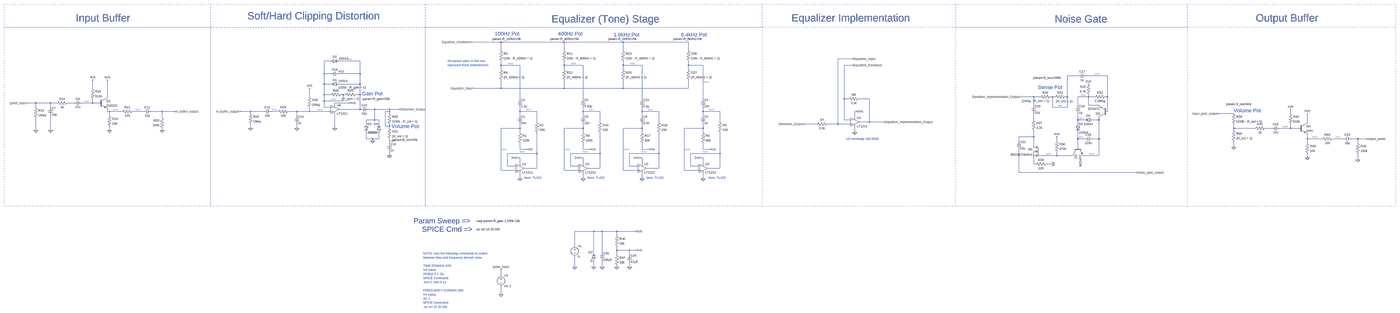
[diagram p0: schematic guitarmageddon.asc, whole sheet]
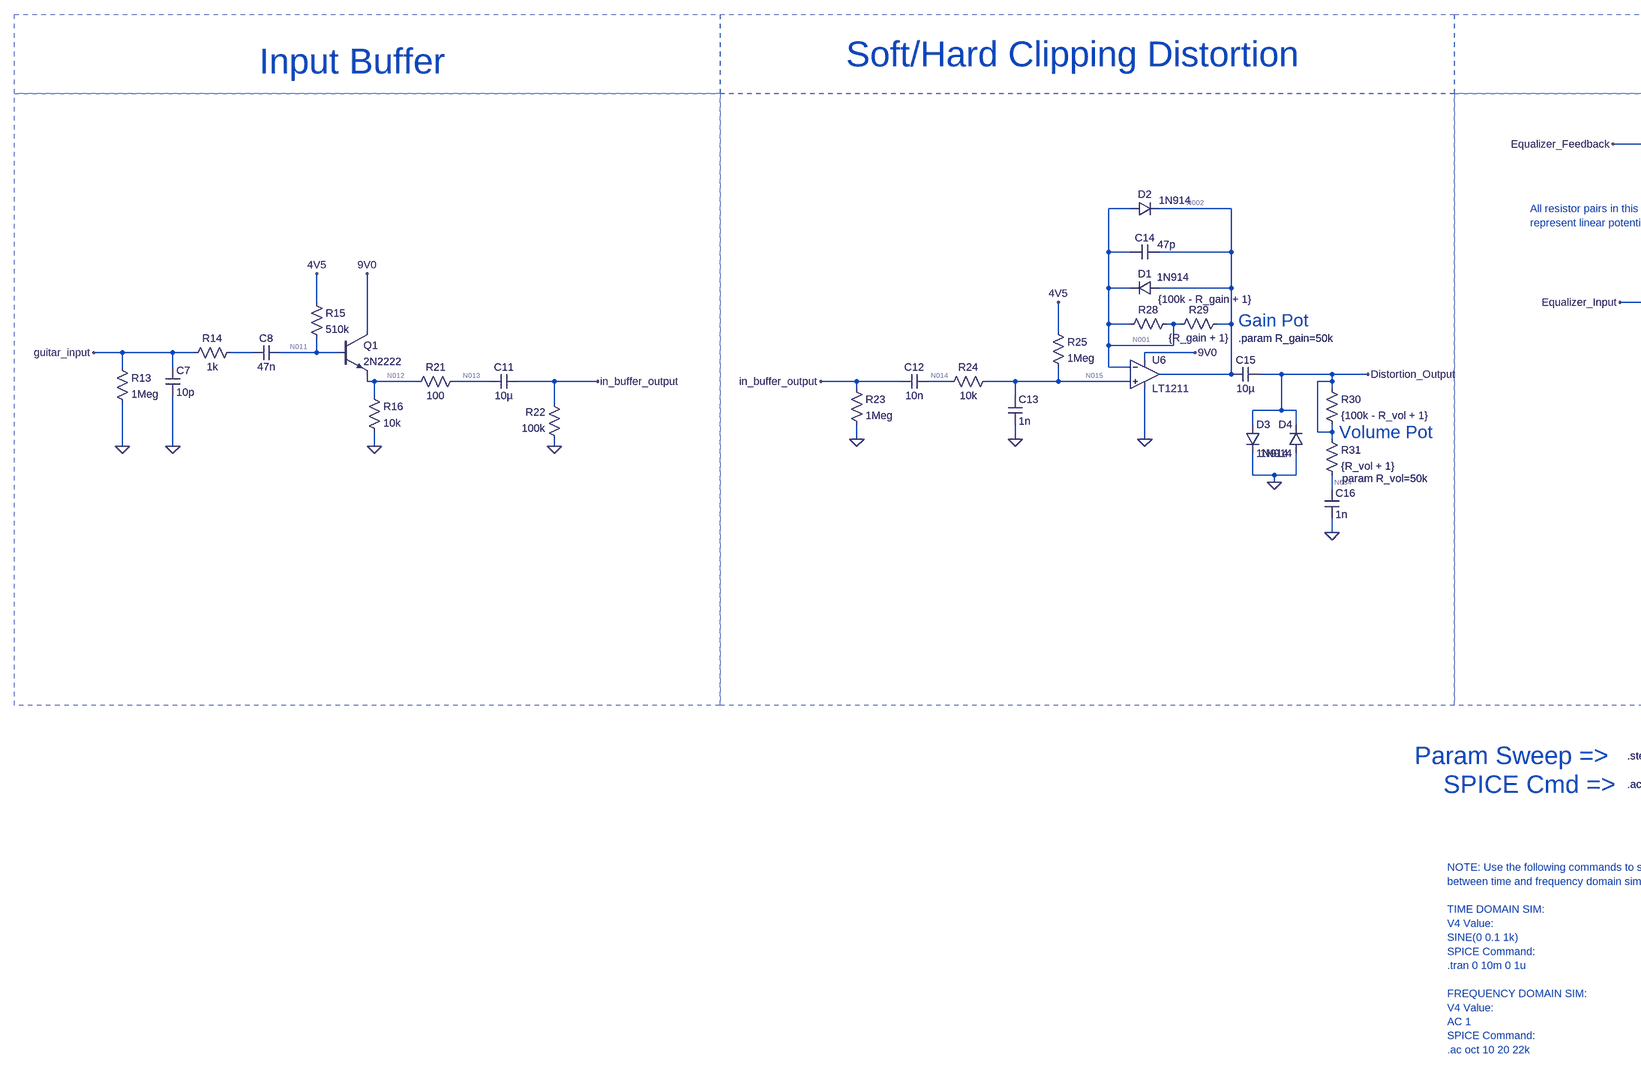
[diagram p1: schematic guitarmageddon.asc, part, row 1 of 1, column 1 of 3]
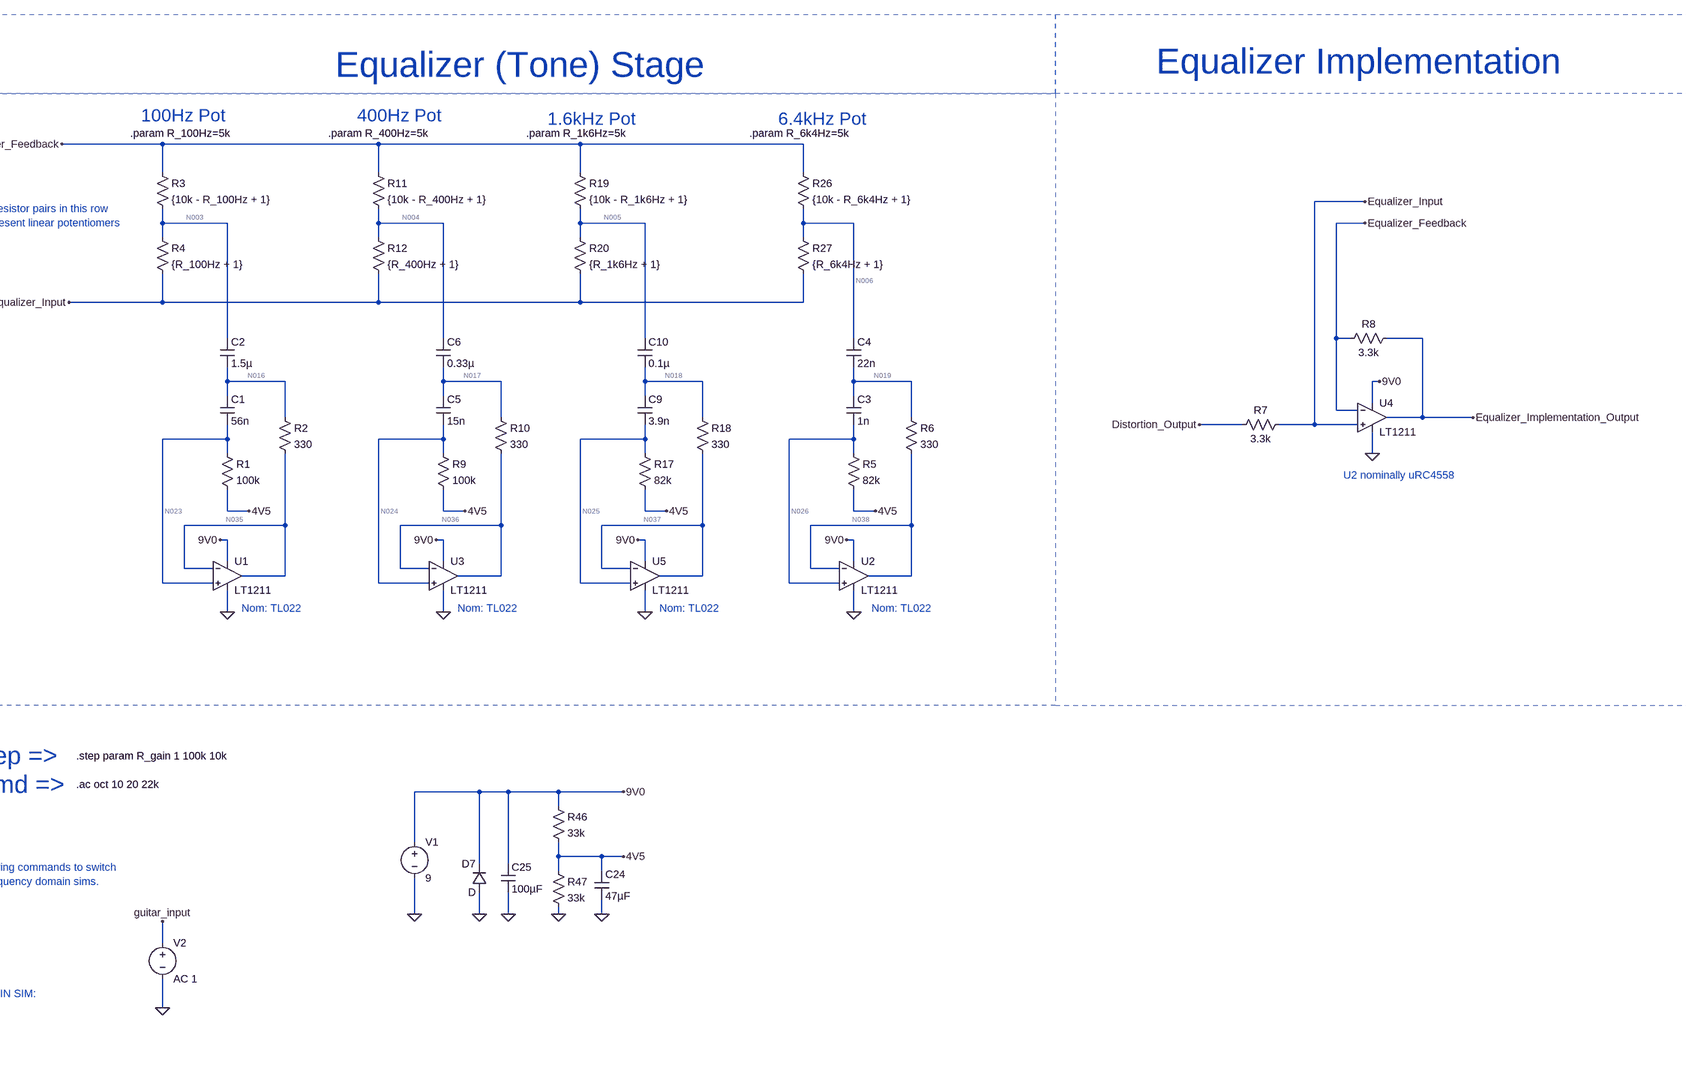
[diagram p2: schematic guitarmageddon.asc, part, row 1 of 1, column 2 of 3]
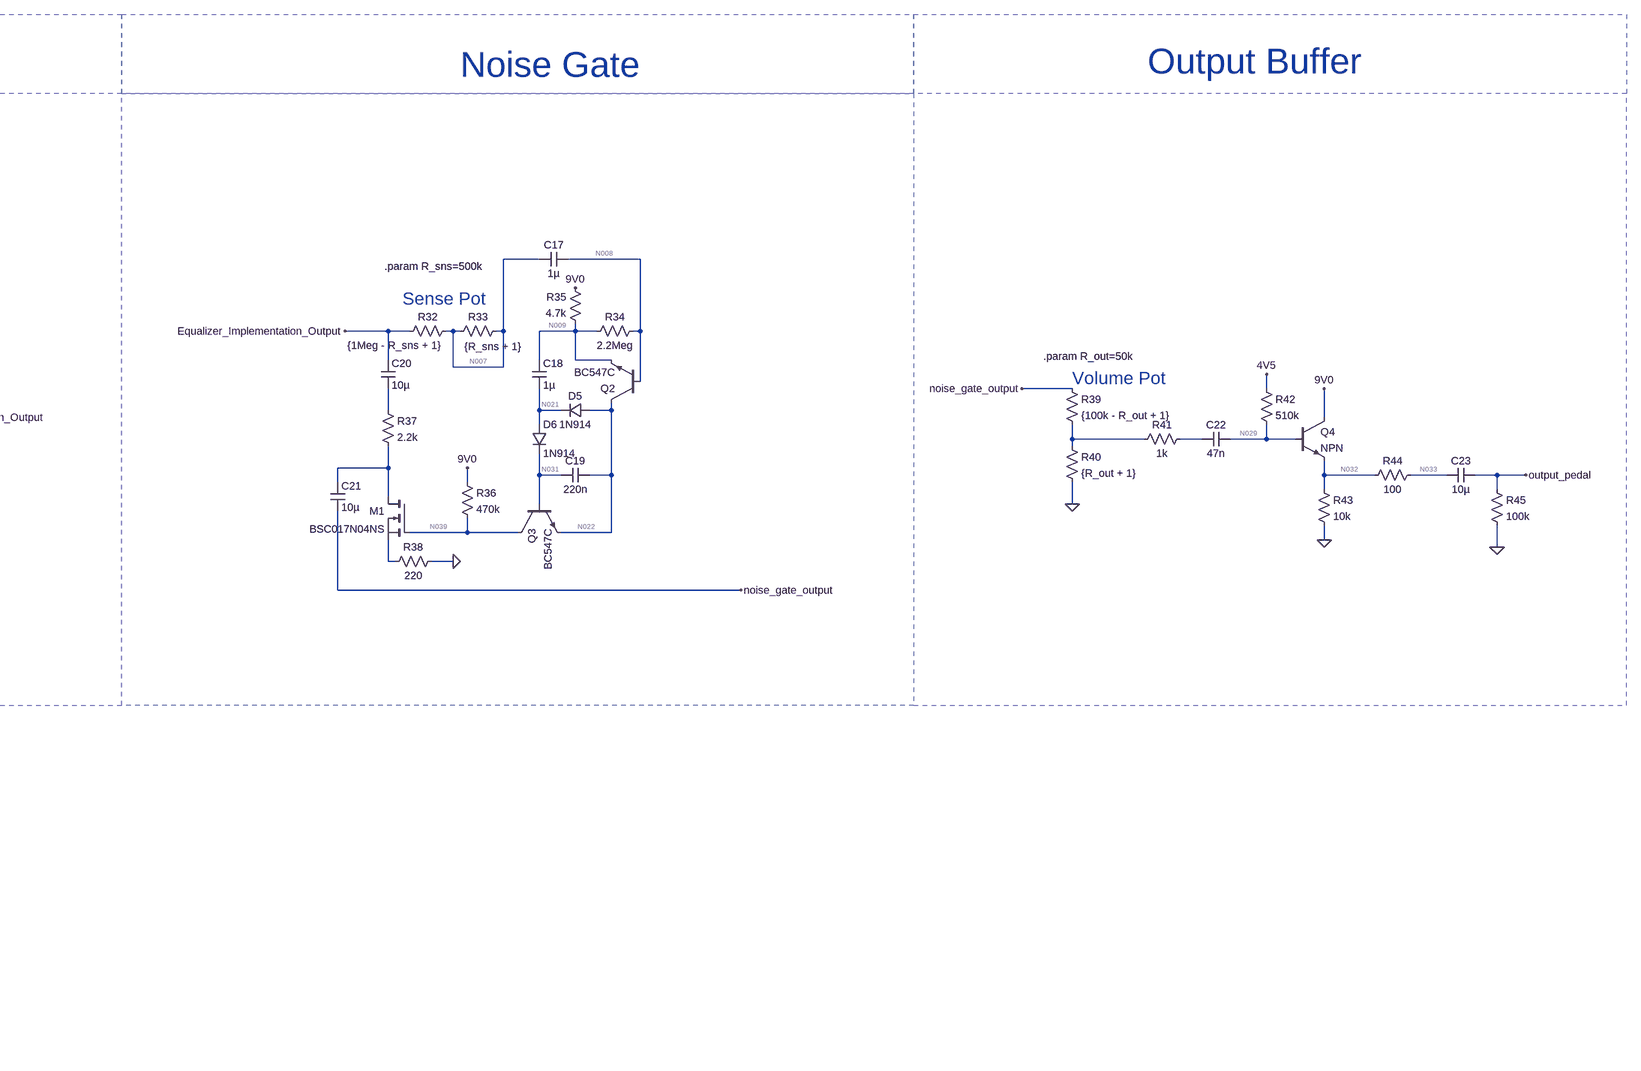
[diagram p3: schematic guitarmageddon.asc, part, row 1 of 1, column 3 of 3]
guitarmageddon.asc, the LTspice schematic file:
Version 4
SHEET 1 5732 1664
WIRE -1072 -512 -1296 -512
WIRE -592 -512 -1072 -512
WIRE -144 -512 -592 -512
WIRE 352 -512 -144 -512
WIRE -1072 -448 -1072 -512
WIRE -592 -448 -592 -512
WIRE -144 -448 -144 -512
WIRE 352 -448 352 -512
WIRE 1600 -384 1488 -384
WIRE -2368 -368 -2416 -368
WIRE -2144 -368 -2304 -368
WIRE -1072 -336 -1072 -368
WIRE -928 -336 -1072 -336
WIRE -592 -336 -592 -368
WIRE -448 -336 -592 -336
WIRE -144 -336 -144 -368
WIRE 0 -336 -144 -336
WIRE 352 -336 352 -368
WIRE 464 -336 352 -336
WIRE 1600 -336 1536 -336
WIRE -1072 -304 -1072 -336
WIRE -592 -304 -592 -336
WIRE -144 -304 -144 -336
WIRE 352 -304 352 -336
WIRE -2416 -272 -2416 -368
WIRE -2368 -272 -2416 -272
WIRE -2144 -272 -2144 -368
WIRE -2144 -272 -2304 -272
WIRE 3312 -256 3232 -256
WIRE 3536 -256 3376 -256
WIRE -2416 -192 -2416 -272
WIRE -2368 -192 -2416 -192
WIRE -2144 -192 -2144 -272
WIRE -2144 -192 -2304 -192
WIRE -4176 -160 -4176 -224
WIRE -1072 -160 -1072 -224
WIRE -1072 -160 -1280 -160
WIRE -592 -160 -592 -224
WIRE -592 -160 -1072 -160
WIRE -144 -160 -144 -224
WIRE -144 -160 -592 -160
WIRE 352 -160 352 -224
WIRE 352 -160 -144 -160
WIRE -2416 -112 -2416 -192
WIRE -2368 -112 -2416 -112
WIRE -2272 -112 -2288 -112
WIRE -2256 -112 -2272 -112
WIRE -2144 -112 -2144 -192
WIRE -2144 -112 -2176 -112
WIRE -4064 -96 -4064 -224
WIRE -2528 -96 -2528 -160
WIRE 2976 -96 2880 -96
WIRE 3024 -96 2976 -96
WIRE 3120 -96 3104 -96
WIRE 3136 -96 3120 -96
WIRE 3232 -96 3232 -256
WIRE 3232 -96 3216 -96
WIRE 3392 -96 3392 -112
WIRE 3392 -96 3312 -96
WIRE 3440 -96 3392 -96
WIRE 3536 -96 3536 -256
WIRE 3536 -96 3520 -96
WIRE -928 -80 -928 -336
WIRE -448 -80 -448 -336
WIRE 0 -80 0 -336
WIRE 464 -80 464 -336
WIRE 1536 -80 1536 -336
WIRE 1568 -80 1536 -80
WIRE 1728 -80 1648 -80
WIRE -2416 -64 -2416 -112
WIRE -2272 -64 -2272 -112
WIRE -2272 -64 -2416 -64
WIRE -4608 -48 -4672 -48
WIRE -4496 -48 -4608 -48
WIRE -4448 -48 -4496 -48
WIRE -4320 -48 -4368 -48
WIRE -4176 -48 -4176 -80
WIRE -4176 -48 -4256 -48
WIRE -4128 -48 -4176 -48
WIRE -2224 -48 -2336 -48
WIRE -2336 -32 -2336 -48
WIRE 2976 -32 2976 -96
WIRE 3312 -32 3312 -96
WIRE 3392 -32 3392 -96
WIRE 3472 -32 3392 -32
WIRE -4608 -16 -4608 -48
WIRE -4496 -16 -4496 -48
WIRE -2416 -16 -2416 -64
WIRE -2368 -16 -2416 -16
WIRE 3120 -16 3120 -96
WIRE 3232 -16 3232 -96
WIRE 3232 -16 3120 -16
WIRE -2144 0 -2144 -112
WIRE -2144 0 -2304 0
WIRE -2032 0 -2080 0
WIRE -1920 0 -2032 0
WIRE -1840 0 -1920 0
WIRE -4064 16 -4064 0
WIRE -4048 16 -4064 16
WIRE -3952 16 -4048 16
WIRE -3792 16 -3872 16
WIRE -3648 16 -3728 16
WIRE -3552 16 -3648 16
WIRE -2976 16 -3056 16
WIRE -2880 16 -2976 16
WIRE -2768 16 -2816 16
WIRE -2624 16 -2688 16
WIRE -2528 16 -2528 -16
WIRE -2528 16 -2624 16
WIRE -2368 16 -2528 16
WIRE -1920 16 -1920 0
WIRE -1920 16 -1952 16
WIRE -928 16 -928 -16
WIRE -800 16 -928 16
WIRE -448 16 -448 -16
WIRE -320 16 -448 16
WIRE 0 16 0 -16
WIRE 128 16 0 16
WIRE 464 16 464 -16
WIRE 592 16 464 16
WIRE 1632 16 1616 16
WIRE 3536 16 3536 -96
WIRE -2976 32 -2976 16
WIRE -1920 32 -1920 16
WIRE 4496 32 4384 32
WIRE 4928 32 4928 0
WIRE -4048 48 -4048 16
WIRE -2624 48 -2624 16
WIRE -928 48 -928 16
WIRE -448 48 -448 16
WIRE 0 48 0 16
WIRE 464 48 464 16
WIRE -3648 64 -3648 16
WIRE 1616 64 1616 16
WIRE -2032 80 -2032 0
WIRE -2032 80 -2096 80
WIRE -2000 80 -2032 80
WIRE 1536 80 1536 -80
WIRE 1584 80 1536 80
WIRE 2976 80 2976 32
WIRE 3312 80 3312 32
WIRE 3360 80 3312 80
WIRE 3472 80 3472 64
WIRE 3472 80 3424 80
WIRE -800 96 -800 16
WIRE -320 96 -320 16
WIRE 128 96 128 16
WIRE 592 96 592 16
WIRE 1728 96 1728 -80
WIRE 1728 96 1648 96
WIRE 1840 96 1728 96
WIRE 5056 96 5056 32
WIRE -2096 112 -2096 80
WIRE -2000 112 -2000 80
WIRE 1328 112 1232 112
WIRE 1488 112 1488 -384
WIRE 1488 112 1408 112
WIRE 1584 112 1488 112
WIRE 3312 112 3312 80
WIRE -1952 128 -1952 16
WIRE -1920 128 -1920 112
WIRE -1920 128 -1952 128
WIRE -2976 144 -2976 112
WIRE -2624 144 -2624 112
WIRE -2336 144 -2336 32
WIRE -1920 144 -1920 128
WIRE -928 144 -928 112
WIRE -928 144 -1072 144
WIRE -448 144 -448 112
WIRE -448 144 -592 144
WIRE 0 144 0 112
WIRE 0 144 -144 144
WIRE 464 144 464 112
WIRE 464 144 320 144
WIRE 4496 144 4496 112
WIRE 4656 144 4496 144
WIRE 4784 144 4736 144
WIRE 4928 144 4928 112
WIRE 4928 144 4848 144
WIRE 4992 144 4928 144
WIRE -4608 160 -4608 64
WIRE -4496 160 -4496 48
WIRE -4048 160 -4048 128
WIRE -3648 160 -3648 144
WIRE 4496 160 4496 144
WIRE -928 176 -928 144
WIRE -448 176 -448 144
WIRE 0 176 0 144
WIRE 464 176 464 144
WIRE 1616 176 1616 128
WIRE 2976 208 2976 160
WIRE 2976 208 2864 208
WIRE -2096 224 -2096 176
WIRE -2048 224 -2096 224
WIRE -2000 224 -2000 176
WIRE -2000 224 -2048 224
WIRE 3312 224 3312 176
WIRE 3360 224 3312 224
WIRE 3472 224 3472 80
WIRE 3472 224 3424 224
WIRE 5056 224 5056 192
WIRE 5168 224 5056 224
WIRE 5328 224 5248 224
WIRE 5440 224 5392 224
WIRE 5504 224 5440 224
WIRE -2048 240 -2048 224
WIRE 2864 240 2864 208
WIRE 3152 240 3152 208
WIRE -1920 256 -1920 224
WIRE 5056 256 5056 224
WIRE 5440 256 5440 224
WIRE 2976 272 2976 208
WIRE 3312 288 3312 224
WIRE 4496 288 4496 240
WIRE -928 304 -928 256
WIRE -880 304 -928 304
WIRE -448 304 -448 256
WIRE -400 304 -448 304
WIRE 0 304 0 256
WIRE 48 304 0 304
WIRE 464 304 464 256
WIRE 512 304 464 304
WIRE -800 336 -800 176
WIRE -800 336 -1024 336
WIRE -320 336 -320 176
WIRE -320 336 -544 336
WIRE 128 336 128 176
WIRE 128 336 -96 336
WIRE 592 336 592 176
WIRE 592 336 368 336
WIRE -1920 352 -1920 320
WIRE 3152 352 3152 320
WIRE 3152 352 3024 352
WIRE 3264 352 3152 352
WIRE 3472 352 3472 224
WIRE 3472 352 3360 352
WIRE -928 368 -944 368
WIRE -448 368 -464 368
WIRE 0 368 -16 368
WIRE 464 368 448 368
WIRE 5056 368 5056 336
WIRE 5440 384 5440 336
WIRE -928 416 -928 368
WIRE -448 416 -448 368
WIRE 0 416 0 368
WIRE 464 416 464 368
WIRE 2976 416 2976 368
WIRE 2992 416 2976 416
WIRE 3120 416 3072 416
WIRE -1024 432 -1024 336
WIRE -960 432 -1024 432
WIRE -544 432 -544 336
WIRE -480 432 -544 432
WIRE -96 432 -96 336
WIRE -32 432 -96 432
WIRE 368 432 368 336
WIRE 432 432 368 432
WIRE -800 448 -800 336
WIRE -800 448 -896 448
WIRE -320 448 -320 336
WIRE -320 448 -416 448
WIRE 128 448 128 336
WIRE 128 448 32 448
WIRE 592 448 592 336
WIRE 592 448 496 448
WIRE -1072 464 -1072 144
WIRE -960 464 -1072 464
WIRE -592 464 -592 144
WIRE -480 464 -592 464
WIRE -144 464 -144 144
WIRE -32 464 -144 464
WIRE 320 464 320 144
WIRE 432 464 320 464
WIRE 2864 480 2864 304
WIRE 3760 480 2864 480
WIRE -928 528 -928 480
WIRE -448 528 -448 480
WIRE 0 528 0 480
WIRE 464 528 464 480
WIRE -368 928 -512 928
WIRE -304 928 -368 928
WIRE -192 928 -304 928
WIRE -48 928 -192 928
WIRE -192 960 -192 928
WIRE -512 1040 -512 928
WIRE -192 1072 -192 1040
WIRE -96 1072 -192 1072
WIRE -48 1072 -96 1072
WIRE -368 1088 -368 928
WIRE -304 1088 -304 928
WIRE -192 1104 -192 1072
WIRE -96 1104 -96 1072
WIRE -512 1200 -512 1120
WIRE -368 1200 -368 1152
WIRE -304 1200 -304 1152
WIRE -192 1200 -192 1184
WIRE -96 1200 -96 1168
WIRE -1072 1264 -1072 1216
WIRE -1072 1408 -1072 1344
FLAG -928 528 0
FLAG -448 528 0
FLAG 0 528 0
FLAG -1280 -160 Equalizer_Input
FLAG -1296 -512 Equalizer_Feedback
FLAG -880 304 4V5
FLAG -400 304 4V5
FLAG 48 304 4V5
FLAG -944 368 9V0
FLAG -464 368 9V0
FLAG -16 368 9V0
FLAG 464 528 0
FLAG 512 304 4V5
FLAG 448 368 9V0
FLAG 1616 176 0
FLAG 1632 16 9V0
FLAG 1600 -384 Equalizer_Input
FLAG 1600 -336 Equalizer_Feedback
FLAG 1840 96 Equalizer_Implementation_Output
FLAG 1232 112 Distortion_Output
FLAG -4672 -48 guitar_input
FLAG -3552 16 in_buffer_output
FLAG -4608 160 0
FLAG -4496 160 0
FLAG -4048 160 0
FLAG -3648 160 0
FLAG -4064 -224 9V0
FLAG -4176 -224 4V5
FLAG -3056 16 in_buffer_output
FLAG -2976 144 0
FLAG -2624 144 0
FLAG -2528 -160 4V5
FLAG -2336 144 0
FLAG -2224 -48 9V0
FLAG -2048 240 0
FLAG -1920 352 0
FLAG -1840 0 Distortion_Output
FLAG 2880 -96 Equalizer_Implementation_Output
FLAG 3152 208 9V0
FLAG 3392 -192 9V0
FLAG 3760 480 noise_gate_output
FLAG 3120 416 0
FLAG 4384 32 noise_gate_output
FLAG 4496 288 0
FLAG 5056 368 0
FLAG 4928 0 4V5
FLAG 5056 32 9V0
FLAG 5440 384 0
FLAG 5504 224 output_pedal
FLAG -192 1200 0
FLAG -96 1200 0
FLAG -48 928 9V0
FLAG -512 1200 0
FLAG -48 1072 4V5
FLAG -368 1200 0
FLAG -304 1200 0
FLAG -1072 1408 0
FLAG -1072 1216 guitar_input
SYMBOL Opamps\\LT1211 -928 384 R0
SYMATTR InstName U1
SYMBOL res -944 160 R0
SYMATTR InstName R1
SYMATTR Value 100k
SYMBOL res -816 80 R0
SYMATTR InstName R2
SYMATTR Value 330
SYMBOL cap -944 48 R0
SYMATTR InstName C1
SYMATTR Value 56n
SYMBOL cap -944 -80 R0
SYMATTR InstName C2
SYMATTR Value 1.5µ
SYMBOL res -1088 -464 R0
SYMATTR InstName R3
SYMATTR Value {10k - R_100Hz + 1}
SYMBOL res -1088 -320 R0
SYMATTR InstName R4
SYMATTR Value {R_100Hz + 1}
SYMBOL Opamps\\LT1211 -448 384 R0
SYMATTR InstName U3
SYMBOL res -464 160 R0
SYMATTR InstName R9
SYMATTR Value 100k
SYMBOL res -336 80 R0
SYMATTR InstName R10
SYMATTR Value 330
SYMBOL cap -464 48 R0
SYMATTR InstName C5
SYMATTR Value 15n
SYMBOL cap -464 -80 R0
SYMATTR InstName C6
SYMATTR Value 0.33µ
SYMBOL res -608 -464 R0
SYMATTR InstName R11
SYMATTR Value {10k - R_400Hz + 1}
SYMBOL res -608 -320 R0
SYMATTR InstName R12
SYMATTR Value {R_400Hz + 1}
SYMBOL Opamps\\LT1211 0 384 R0
SYMATTR InstName U5
SYMBOL res -16 160 R0
SYMATTR InstName R17
SYMATTR Value 82k
SYMBOL res 112 80 R0
SYMATTR InstName R18
SYMATTR Value 330
SYMBOL cap -16 48 R0
SYMATTR InstName C9
SYMATTR Value 3.9n
SYMBOL cap -16 -80 R0
SYMATTR InstName C10
SYMATTR Value 0.1µ
SYMBOL res -160 -464 R0
SYMATTR InstName R19
SYMATTR Value {10k - R_1k6Hz + 1}
SYMBOL res -160 -320 R0
SYMATTR InstName R20
SYMATTR Value {R_1k6Hz + 1}
SYMBOL res 336 -464 R0
SYMATTR InstName R26
SYMATTR Value {10k - R_6k4Hz + 1}
SYMBOL res 336 -320 R0
SYMATTR InstName R27
SYMATTR Value {R_6k4Hz + 1}
SYMBOL Opamps\\LT1211 464 384 R0
SYMATTR InstName U2
SYMBOL res 448 160 R0
SYMATTR InstName R5
SYMATTR Value 82k
SYMBOL res 576 80 R0
SYMATTR InstName R6
SYMATTR Value 330
SYMBOL cap 448 48 R0
SYMATTR InstName C3
SYMATTR Value 1n
SYMBOL cap 448 -80 R0
SYMATTR InstName C4
SYMATTR Value 22n
SYMBOL res 1424 96 R90
WINDOW 0 0 56 VBottom 2
WINDOW 3 32 56 VTop 2
SYMATTR InstName R7
SYMATTR Value 3.3k
SYMBOL Opamps\\LT1211 1616 32 R0
SYMATTR InstName U4
SYMBOL res 1664 -96 R90
WINDOW 0 0 56 VBottom 2
WINDOW 3 32 56 VTop 2
SYMATTR InstName R8
SYMATTR Value 3.3k
SYMBOL res -4352 -64 R90
WINDOW 0 0 56 VBottom 2
WINDOW 3 32 56 VTop 2
SYMATTR InstName R14
SYMATTR Value 1k
SYMBOL cap -4256 -64 R90
WINDOW 0 0 32 VBottom 2
WINDOW 3 32 32 VTop 2
SYMATTR InstName C8
SYMATTR Value 47n
SYMBOL res -4192 -176 R0
SYMATTR InstName R15
SYMATTR Value 510k
SYMBOL res -4064 32 R0
SYMATTR InstName R16
SYMATTR Value 10k
SYMBOL res -3856 0 R90
WINDOW 0 0 56 VBottom 2
WINDOW 3 32 56 VTop 2
SYMATTR InstName R21
SYMATTR Value 100
SYMBOL res -3632 160 R180
WINDOW 0 36 76 Left 2
WINDOW 3 36 40 Left 2
SYMATTR InstName R22
SYMATTR Value 100k
SYMBOL cap -3728 0 R90
WINDOW 0 0 32 VBottom 2
WINDOW 3 32 32 VTop 2
SYMATTR InstName C11
SYMATTR Value 10µ
SYMBOL res -4624 -32 R0
SYMATTR InstName R13
SYMATTR Value 1Meg
SYMBOL cap -4512 -16 R0
SYMATTR InstName C7
SYMATTR Value 10p
SYMBOL npn -4128 -96 R0
SYMATTR InstName Q1
SYMATTR Value 2N2222
SYMBOL res -2992 16 R0
SYMATTR InstName R23
SYMATTR Value 1Meg
SYMBOL cap -2816 0 R90
WINDOW 0 0 32 VBottom 2
WINDOW 3 32 32 VTop 2
SYMATTR InstName C12
SYMATTR Value 10n
SYMBOL res -2672 0 R90
WINDOW 0 0 56 VBottom 2
WINDOW 3 32 56 VTop 2
SYMATTR InstName R24
SYMATTR Value 10k
SYMBOL cap -2640 48 R0
SYMATTR InstName C13
SYMATTR Value 1n
SYMBOL res -2544 -112 R0
SYMATTR InstName R25
SYMATTR Value 1Meg
SYMBOL Opamps\\LT1211 -2336 -64 R0
SYMATTR InstName U6
SYMBOL cap -2304 -288 R90
WINDOW 0 0 32 VBottom 2
WINDOW 3 -16 -16 VTop 2
SYMATTR InstName C14
SYMATTR Value 47p
SYMBOL res -2272 -128 R90
WINDOW 0 0 56 VBottom 2
WINDOW 3 -39 34 VLeft 2
SYMATTR InstName R28
SYMATTR Value {100k - R_gain + 1}
SYMBOL res -2160 -128 R90
WINDOW 0 0 56 VBottom 2
WINDOW 3 32 56 VTop 2
SYMATTR InstName R29
SYMATTR Value {R_gain + 1}
SYMBOL diode -2304 -208 R90
WINDOW 0 0 32 VBottom 2
WINDOW 3 -23 -31 VTop 2
SYMATTR InstName D1
SYMATTR Value 1N914
SYMBOL diode -2368 -352 R270
WINDOW 0 32 32 VTop 2
WINDOW 3 50 99 VBottom 2
SYMATTR InstName D2
SYMATTR Value 1N914
SYMBOL cap -2080 -16 R90
WINDOW 0 0 32 VBottom 2
WINDOW 3 32 32 VTop 2
SYMATTR InstName C15
SYMATTR Value 10µ
SYMBOL res -1936 16 R0
SYMATTR InstName R30
SYMATTR Value {100k - R_vol + 1}
SYMBOL diode -2112 112 R0
SYMATTR InstName D3
SYMATTR Value 1N914
SYMBOL diode -1984 176 R180
WINDOW 0 24 64 Left 2
WINDOW 3 24 0 Left 2
SYMATTR InstName D4
SYMATTR Value 1N914
SYMBOL res -1936 128 R0
SYMATTR InstName R31
SYMATTR Value {R_vol + 1}
SYMBOL cap -1936 256 R0
SYMATTR InstName C16
SYMATTR Value 1n
SYMBOL res 3120 -112 R90
WINDOW 0 0 56 VBottom 2
WINDOW 3 32 130 VTop 2
SYMATTR InstName R32
SYMATTR Value {1Meg - R_sns + 1}
SYMBOL res 3232 -112 R90
WINDOW 0 0 56 VBottom 2
WINDOW 3 35 24 VTop 2
SYMATTR InstName R33
SYMATTR Value {R_sns + 1}
SYMBOL cap 3376 -272 R90
WINDOW 0 0 32 VBottom 2
WINDOW 3 32 32 VTop 2
SYMATTR InstName C17
SYMATTR Value 1µ
SYMBOL res 3536 -112 R90
WINDOW 0 0 56 VBottom 2
WINDOW 3 32 56 VTop 2
SYMATTR InstName R34
SYMATTR Value 2.2Meg
SYMBOL res 3408 -96 R180
WINDOW 0 36 76 Left 2
WINDOW 3 36 40 Left 2
SYMATTR InstName R35
SYMATTR Value 4.7k
SYMBOL cap 3296 -32 R0
SYMATTR InstName C18
SYMATTR Value 1µ
SYMBOL diode 3424 64 R90
WINDOW 0 0 32 VBottom 2
WINDOW 3 32 32 VTop 2
SYMATTR InstName D5
SYMATTR Value 1N914
SYMBOL diode 3296 112 R0
SYMATTR InstName D6
SYMATTR Value 1N914
SYMBOL cap 3424 208 R90
WINDOW 0 0 32 VBottom 2
WINDOW 3 32 32 VTop 2
SYMATTR InstName C19
SYMATTR Value 220n
SYMBOL npn 3536 64 R180
SYMATTR InstName Q2
SYMATTR Value BC547C
SYMBOL npn 3264 288 M90
SYMATTR InstName Q3
SYMATTR Value BC547C
SYMBOL res 3136 224 R0
SYMATTR InstName R36
SYMATTR Value 470k
SYMBOL cap 2960 -32 R0
SYMATTR InstName C20
SYMATTR Value 10µ
SYMBOL res 2960 64 R0
SYMATTR InstName R37
SYMATTR Value 2.2k
SYMBOL nmos 3024 272 M0
SYMATTR InstName M1
SYMATTR Value BSC017N04NS
SYMBOL cap 2848 240 R0
SYMATTR InstName C21
SYMATTR Value 10µ
SYMBOL res 3088 400 R90
WINDOW 0 0 56 VBottom 2
WINDOW 3 32 56 VTop 2
SYMATTR InstName R38
SYMATTR Value 220
SYMBOL res 4480 16 R0
SYMATTR InstName R39
SYMATTR Value {100k - R_out + 1}
SYMBOL res 4480 144 R0
SYMATTR InstName R40
SYMATTR Value {R_out + 1}
SYMBOL res 4752 128 R90
WINDOW 0 0 56 VBottom 2
WINDOW 3 32 56 VTop 2
SYMATTR InstName R41
SYMATTR Value 1k
SYMBOL cap 4848 128 R90
WINDOW 0 0 32 VBottom 2
WINDOW 3 32 32 VTop 2
SYMATTR InstName C22
SYMATTR Value 47n
SYMBOL res 4912 16 R0
SYMATTR InstName R42
SYMATTR Value 510k
SYMBOL npn 4992 96 R0
SYMATTR InstName Q4
SYMBOL res 5040 240 R0
SYMATTR InstName R43
SYMATTR Value 10k
SYMBOL res 5264 208 R90
WINDOW 0 0 56 VBottom 2
WINDOW 3 32 56 VTop 2
SYMATTR InstName R44
SYMATTR Value 100
SYMBOL cap 5392 208 R90
WINDOW 0 0 32 VBottom 2
WINDOW 3 32 32 VTop 2
SYMATTR InstName C23
SYMATTR Value 10µ
SYMBOL res 5424 240 R0
SYMATTR InstName R45
SYMATTR Value 100k
SYMBOL res -208 944 R0
SYMATTR InstName R46
SYMATTR Value 33k
SYMBOL res -208 1088 R0
SYMATTR InstName R47
SYMATTR Value 33k
SYMBOL cap -112 1104 R0
SYMATTR InstName C24
SYMATTR Value 47µF
SYMBOL voltage -512 1024 R0
SYMATTR InstName V1
SYMATTR Value 9
SYMATTR SpiceLine Rser=0
SYMBOL cap -320 1088 R0
SYMATTR InstName C25
SYMATTR Value 100µF
SYMBOL diode -352 1152 R180
WINDOW 0 24 64 Left 2
WINDOW 3 24 0 Left 2
SYMATTR InstName D7
SYMBOL voltage -1072 1248 R0
SYMATTR InstName V2
SYMATTR Value AC 1
SYMATTR SpiceLine Rser=0
TEXT -1120 -576 Left 4 ;100Hz Pot
TEXT -640 -576 Left 4 ;400Hz Pot
TEXT -216 -568 Left 4 ;1.6kHz Pot
TEXT 296 -568 Left 4 ;6.4kHz Pot
TEXT -688 -688 Left 6 ;Equalizer (Tone) Stage
TEXT -1144 -536 Left 2 !.param R_100Hz=5k
TEXT -704 -536 Left 2 !.param R_400Hz=5k
TEXT -264 -536 Left 2 !.param R_1k6Hz=5k
TEXT -896 520 Left 2 ;Nom: TL022
TEXT -416 520 Left 2 ;Nom: TL022
TEXT 32 520 Left 2 ;Nom: TL022
TEXT -1480 -368 Left 2 ;All resistor pairs in this row \nrepresent linear potentiomers
TEXT 504 520 Left 2 ;Nom: TL022
TEXT 232 -536 Left 2 !.param R_6k4Hz=5k
TEXT 1552 224 Left 2 ;U2 nominally uRC4558
TEXT 1136 -696 Left 6 ;Equalizer Implementation
TEXT -3000 -712 Left 6 ;Soft/Hard Clipping Distortion
TEXT -4304 -696 Left 6 ;Input Buffer
TEXT 3136 -688 Left 6 ;Noise Gate
TEXT 4664 -696 Left 6 ;Output Buffer
TEXT 3008 -168 Left 4 ;Sense Pot
TEXT -2128 -120 Left 4 ;Gain Pot
TEXT -1904 128 Left 4 ;Volume Pot
TEXT 4496 8 Left 4 ;Volume Pot
TEXT -1664 1096 Left 2 ;NOTE: Use the following commands to switch \nbetween time and frequency domain sims.\n \nTIME DOMAIN SIM:\nV4 Value: \nSINE(0 0.1 1k)\nSPICE Command: \n.tran 0 10m 0 1u\n \nFREQUENCY DOMAIN SIM:\nV4 Value: \nAC 1\nSPICE Command:\n.ac oct 10 20 22k
TEXT -1264 848 Left 2 !.step param R_gain 1 100k 10k
TEXT -1264 912 Left 2 !.ac oct 10 20 22k
TEXT -1672 912 Left 5 ;SPICE Cmd =>
TEXT -1736 848 Left 5 ;Param Sweep =>
TEXT -2128 -80 Left 2 !.param R_gain=50k
TEXT -1904 232 Left 2 !.param R_vol=50k
TEXT 2968 -240 Left 2 !.param R_sns=500k
TEXT 4432 -40 Left 2 !.param R_out=50k
RECTANGLE Normal 912 736 -1648 -624 2
RECTANGLE Normal 2384 -624 912 736 2
RECTANGLE Normal -1648 736 -3280 -624 2
RECTANGLE Normal -4848 -624 -3280 736 2
RECTANGLE Normal 4144 736 2384 -624 2
RECTANGLE Normal 5728 -624 4144 736 2
RECTANGLE Normal 4144 -800 5728 -624 2
RECTANGLE Normal 2384 -800 4144 -624 2
RECTANGLE Normal 912 -800 2384 -624 2
RECTANGLE Normal -1648 -800 912 -624 2
RECTANGLE Normal -3280 -800 -1648 -624 2
RECTANGLE Normal -4848 -800 -3280 -624 2

The netlist it stands for:
* guitarmageddon.asc
XU1 N023 N035 9V0 0 N035 LT1211  ; pins In+ In- V+ V- OUT
R1 N023 4V5 100k
R2 N016 N035 330
C1 N016 N023 56n
C2 N003 N016 1.5µ
R3 Equalizer_Feedback N003 {10k - R_100Hz + 1}
R4 N003 Equalizer_Input {R_100Hz + 1}
XU3 N024 N036 9V0 0 N036 LT1211  ; pins In+ In- V+ V- OUT
R9 N024 4V5 100k
R10 N017 N036 330
C5 N017 N024 15n
C6 N004 N017 0.33µ
R11 Equalizer_Feedback N004 {10k - R_400Hz + 1}
R12 N004 Equalizer_Input {R_400Hz + 1}
XU5 N025 N037 9V0 0 N037 LT1211  ; pins In+ In- V+ V- OUT
R17 N025 4V5 82k
R18 N018 N037 330
C9 N018 N025 3.9n
C10 N005 N018 0.1µ
R19 Equalizer_Feedback N005 {10k - R_1k6Hz + 1}
R20 N005 Equalizer_Input {R_1k6Hz + 1}
R26 Equalizer_Feedback N006 {10k - R_6k4Hz + 1}
R27 N006 Equalizer_Input {R_6k4Hz + 1}
XU2 N026 N038 9V0 0 N038 LT1211  ; pins In+ In- V+ V- OUT
R5 N026 4V5 82k
R6 N019 N038 330
C3 N019 N026 1n
C4 N006 N019 22n
R7 Equalizer_Input Distortion_Output 3.3k
XU4 Equalizer_Input Equalizer_Feedback 9V0 0 Equalizer_Implementation_Output LT1211  ; pins In+ In- V+ V- OUT
R8 Equalizer_Implementation_Output Equalizer_Feedback 3.3k
R14 N010 guitar_input 1k
C8 N011 N010 47n
R15 4V5 N011 510k
R16 N012 0 10k
R21 N013 N012 100
R22 0 in_buffer_output 100k
C11 in_buffer_output N013 10µ
R13 guitar_input 0 1Meg
C7 guitar_input 0 10p
Q1 9V0 N011 N012 0 2N2222
R23 in_buffer_output 0 1Meg
C12 N014 in_buffer_output 10n
R24 N015 N014 10k
C13 N015 0 1n
R25 4V5 N015 1Meg
XU6 N015 N001 9V0 0 N002 LT1211  ; pins In+ In- V+ V- OUT
C14 N002 N001 47p
R28 N001 N001 {100k - R_gain + 1}
R29 N002 N001 {R_gain + 1}
D1 N002 N001 1N914
D2 N001 N002 1N914
C15 Distortion_Output N002 10µ
R30 Distortion_Output Distortion_Output {100k - R_vol + 1}
D3 Distortion_Output 0 1N914
D4 0 Distortion_Output 1N914
R31 Distortion_Output N034 {R_vol + 1}
C16 N034 0 1n
R32 N007 Equalizer_Implementation_Output {1Meg - R_sns + 1}
R33 N007 N007 {R_sns + 1}
C17 N008 N007 1µ
R34 N008 N009 2.2Meg
R35 N009 9V0 4.7k
C18 N009 N021 1µ
D5 N022 N021 1N914
D6 N021 N031 1N914
C19 N022 N031 220n
Q2 N022 N008 N009 0 BC547C
Q3 N039 N031 N022 0 BC547C
R36 9V0 N039 470k
C20 Equalizer_Implementation_Output N020 10µ
R37 N020 N030 2.2k
M1 N030 N039 N040 N040 BSC017N04NS
C21 N030 noise_gate_output 10µ
R38 0 N040 220
R39 noise_gate_output N027 {100k - R_out + 1}
R40 N027 0 {R_out + 1}
R41 N028 N027 1k
C22 N029 N028 47n
R42 4V5 N029 510k
Q4 9V0 N029 N032 0 NPN
R43 N032 0 10k
R44 N033 N032 100
C23 output_pedal N033 10µ
R45 output_pedal 0 100k
R46 9V0 4V5 33k
R47 4V5 0 33k
C24 4V5 0 47µF
V1 9V0 0 9 Rser=0
C25 9V0 0 100µF
D7 0 9V0 D
V2 guitar_input 0 AC 1 Rser=0
.model D D
.lib standard.dio
.model NPN NPN
.model PNP PNP
.lib standard.bjt
.model NMOS NMOS
.model PMOS PMOS
.lib standard.mos
* 100Hz Pot
* 400Hz Pot
* 1.6kHz Pot
* 6.4kHz Pot
* Equalizer (Tone) Stage
.param R_100Hz=5k
.param R_400Hz=5k
.param R_1k6Hz=5k
* Nom: TL022
* Nom: TL022
* Nom: TL022
* All resistor pairs in this row
* represent linear potentiomers
* Nom: TL022
.param R_6k4Hz=5k
* U2 nominally uRC4558
* Equalizer Implementation
* Soft/Hard Clipping Distortion
* Input Buffer
* Noise Gate
* Output Buffer
* Sense Pot
* Gain Pot
* Volume Pot
* Volume Pot
* NOTE: Use the following commands to switch
* between time and frequency domain sims.
* TIME DOMAIN SIM:
* V4 Value:
* SINE(0 0.1 1k)
* SPICE Command:
* .tran 0 10m 0 1u
* FREQUENCY DOMAIN SIM:
* V4 Value:
* AC 1
* SPICE Command:
* .ac oct 10 20 22k
.step param R_gain 1 100k 10k
.ac oct 10 20 22k
* SPICE Cmd =>
* Param Sweep =>
.param R_gain=50k
.param R_vol=50k
.param R_sns=500k
.param R_out=50k
.lib LTC.lib
.backanno
.end

* Results of the author's LTspice run, read from the files saved beside the schematic
* Operating Point (first step), zero values left out:
*   r_gain = 1 
*   V(n035) = 4.445 V
*   V(n023) = 4.445 V
*   V(9v0) = 9 V
*   V(4v5) = 4.44 V
*   V(n016) = 4.445 V
*   V(n003) = 143.6 mV
*   V(equalizer_feedback) = 143.6 mV
*   V(equalizer_input) = 143.6 mV
*   V(n036) = 4.445 V
*   V(n024) = 4.445 V
*   V(n017) = 4.445 V
*   V(n004) = 143.6 mV
*   V(n037) = 4.444 V
*   V(n025) = 4.444 V
*   V(n018) = 4.444 V
*   V(n005) = 143.6 mV
*   V(n006) = 143.6 mV
*   V(n038) = 4.444 V
*   V(n026) = 4.444 V
*   V(n019) = 4.444 V
*   V(distortion_output) = 143.4 mV
*   V(equalizer_implementation_output) = 143.4 mV
*   V(n011) = 3.698 V
*   V(n012) = 3.075 V
*   V(n013) = 3.075 V
*   V(n014) = 4.49 V
*   V(n015) = 4.49 V
*   V(n001) = 4.49 V
*   V(n002) = 4.49 V
*   V(n034) = 143.4 mV
*   V(n007) = 143.4 mV
*   V(n008) = 9 V
*   V(n009) = 9 V
*   V(n021) = 8.999 V
*   V(n022) = 8.999 V
*   V(n031) = 8.999 V
*   V(n039) = 9 V
*   V(n029) = 3.198 V
*   V(n032) = 2.46 V
*   V(n033) = 2.46 V
*   Ic(Q4) = 243.6 µA
*   Ib(Q4) = 2.436 µA
*   Ie(Q4) = -246 µA
*   Ic(Q1) = 306 µA
*   Ib(Q1) = 1.455 µA
*   Ie(Q1) = -307.5 µA
*   Id(M1) = 1.2 nA
*   Ig(M1) = -1.2 nA
*   I(D7) = -9.01 pA
*   I(D4) = -2.414 nA
*   I(D3) = 57.17 nA
*   I(R47) = 134.5 µA
*   I(R46) = 138.2 µA
*   I(R43) = 246 µA
*   I(R42) = 2.436 µA
*   I(R29) = -50.02 nA
*   I(R25) = -50.02 nA
*   I(R16) = 307.5 µA
*   I(R15) = 1.455 µA
*   I(R8) = -57.84 nA
*   I(R7) = 59.58 nA
*   I(R5) = 50.11 nA
*   I(R27) = 217.4 pA
*   I(R26) = 217.4 pA
*   I(R20) = 217.4 pA
*   I(R19) = 217.4 pA
*   I(R17) = 50.11 nA
*   I(R12) = 217.4 pA
*   I(R11) = 217.4 pA
*   I(R9) = 50.11 nA
*   I(R4) = 217.4 pA
*   I(R3) = 217.4 pA
*   I(R1) = 50.11 nA
*   I(V1) = -9.102 mA
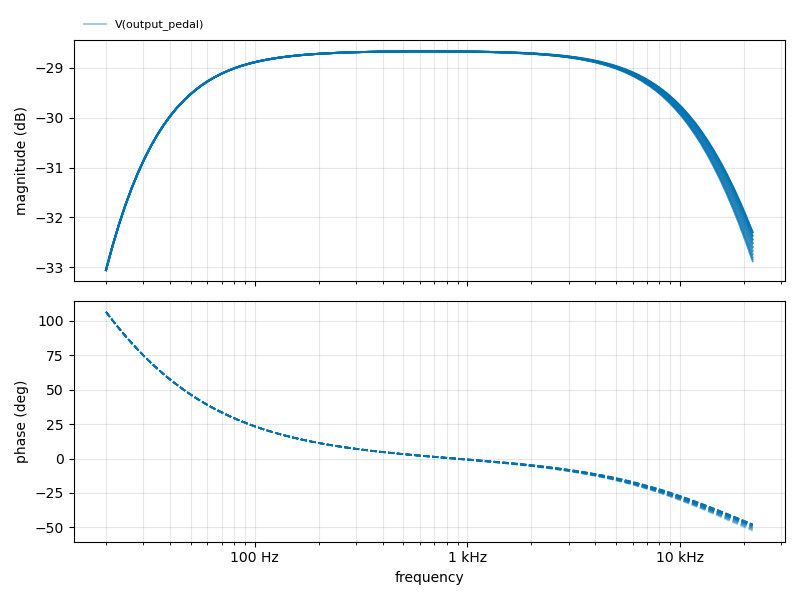
[diagram p4: AC Analysis of guitarmageddon.asc, plotted from the saved traces]
* AC Analysis, 11 runs:
*   V(output_pedal) [r_gain=1]: -33.05 dB at 20 Hz, -32.88 dB at 22 kHz, peak -28.68 dB at 640 Hz, 3 dB below the peak at 25.01 Hz and 17.22 kHz
*   V(output_pedal) [r_gain=10001]: -33.05 dB at 20 Hz, -32.87 dB at 22 kHz, peak -28.68 dB at 640 Hz, 3 dB below the peak at 25.01 Hz and 17.24 kHz
*   V(output_pedal) [r_gain=20001]: -33.05 dB at 20 Hz, -32.84 dB at 22 kHz, peak -28.68 dB at 640 Hz, 3 dB below the peak at 25.01 Hz and 17.32 kHz
*   V(output_pedal) [r_gain=30001]: -33.05 dB at 20 Hz, -32.79 dB at 22 kHz, peak -28.68 dB at 640 Hz, 3 dB below the peak at 25.01 Hz and 17.44 kHz
*   V(output_pedal) [r_gain=40001]: -33.05 dB at 20 Hz, -32.74 dB at 22 kHz, peak -28.68 dB at 640 Hz, 3 dB below the peak at 25.01 Hz and 17.6 kHz
*   V(output_pedal) [r_gain=50001]: -33.05 dB at 20 Hz, -32.67 dB at 22 kHz, peak -28.68 dB at 640 Hz, 3 dB below the peak at 25.01 Hz and 17.8 kHz
*   V(output_pedal) [r_gain=60001]: -33.05 dB at 20 Hz, -32.59 dB at 22 kHz, peak -28.67 dB at 640 Hz, 3 dB below the peak at 25.02 Hz and 18.03 kHz
*   V(output_pedal) [r_gain=70001]: -33.05 dB at 20 Hz, -32.52 dB at 22 kHz, peak -28.67 dB at 640 Hz, 3 dB below the peak at 25.02 Hz and 18.29 kHz